# EasyEDA Pro project ProPrj_AD采集模组_2025-10-15.epro, board PCB1
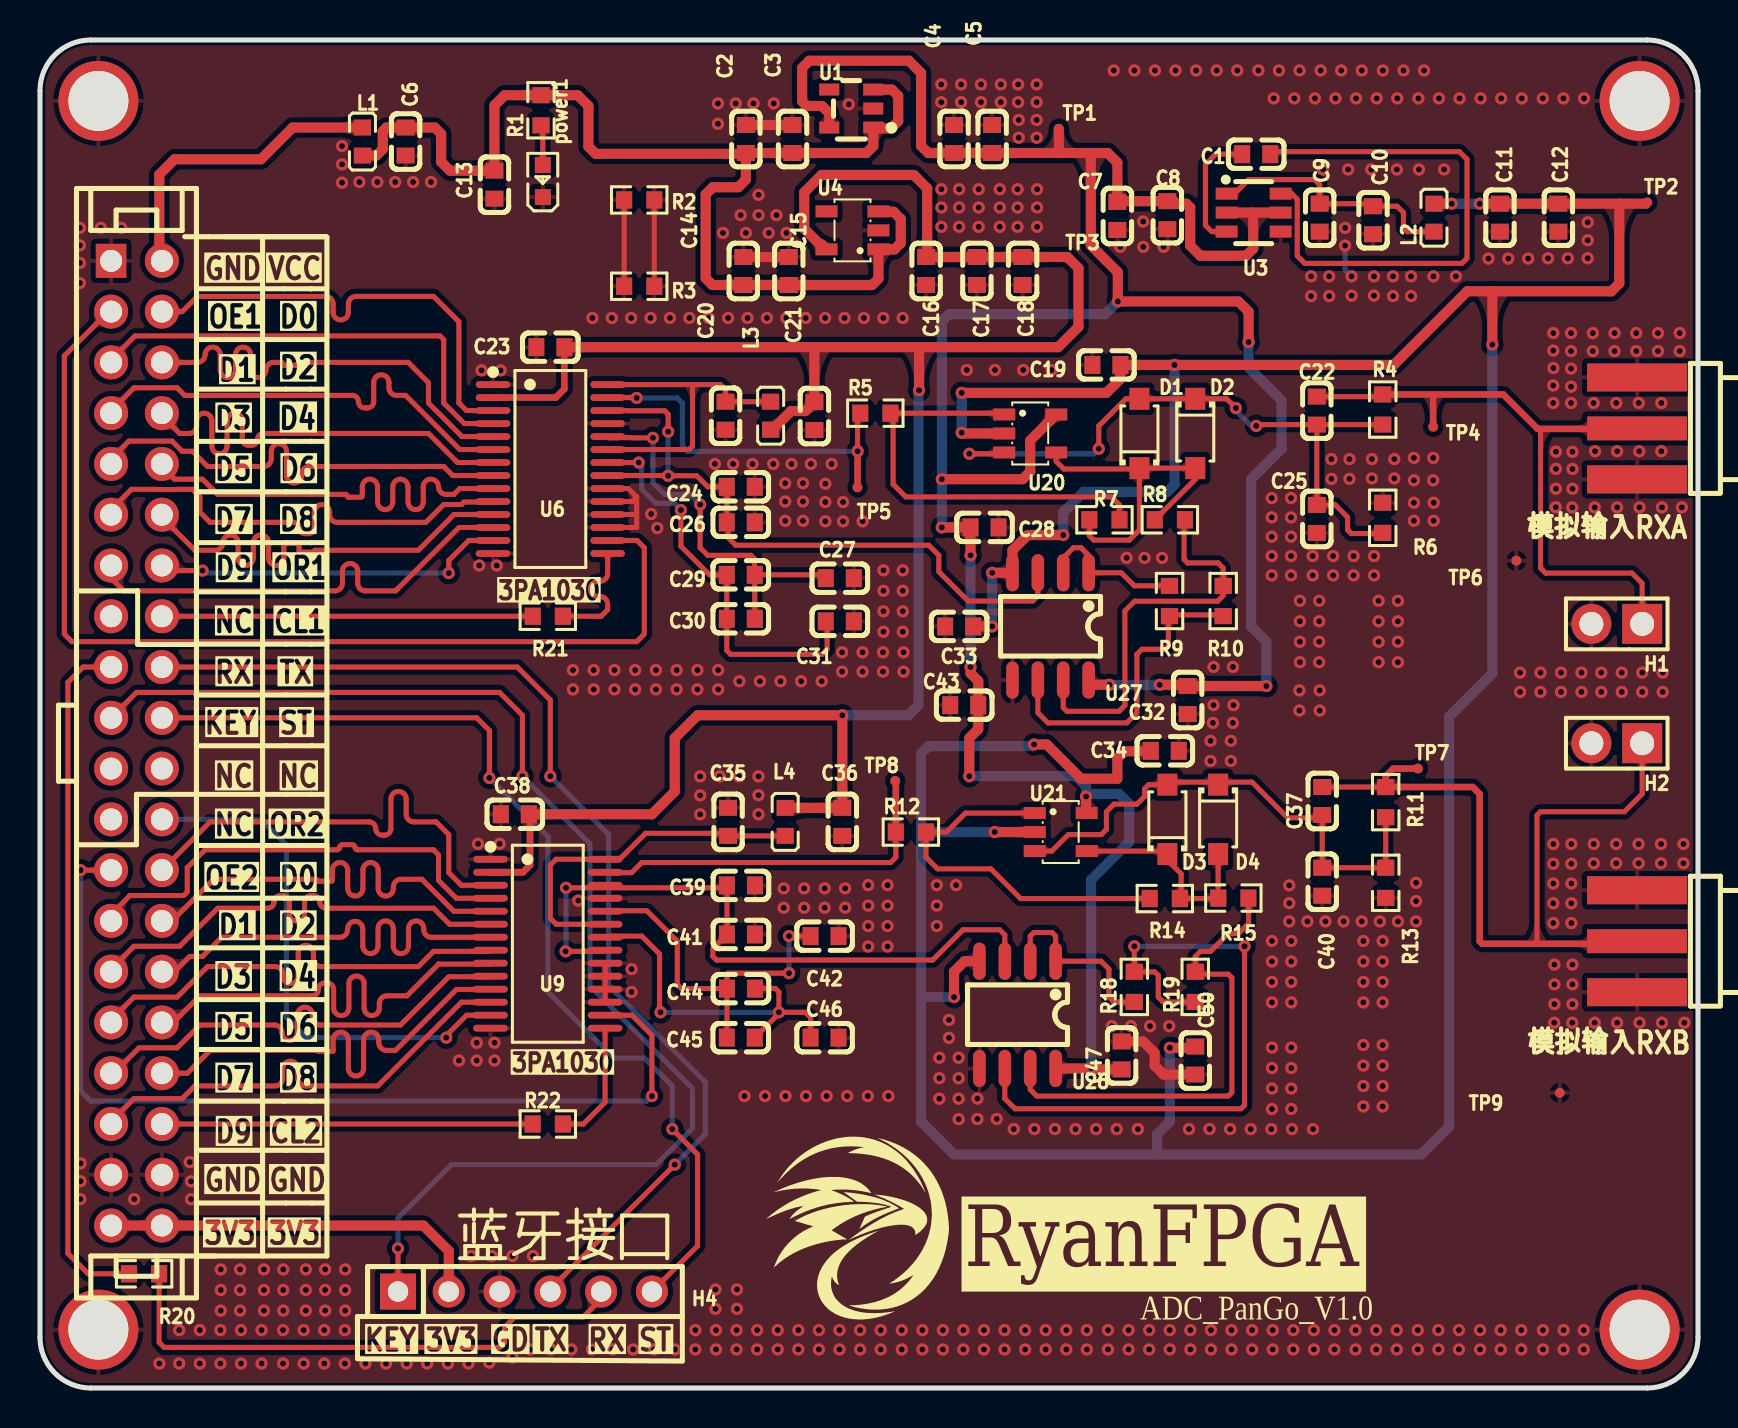
[diagram p1: board, top side]
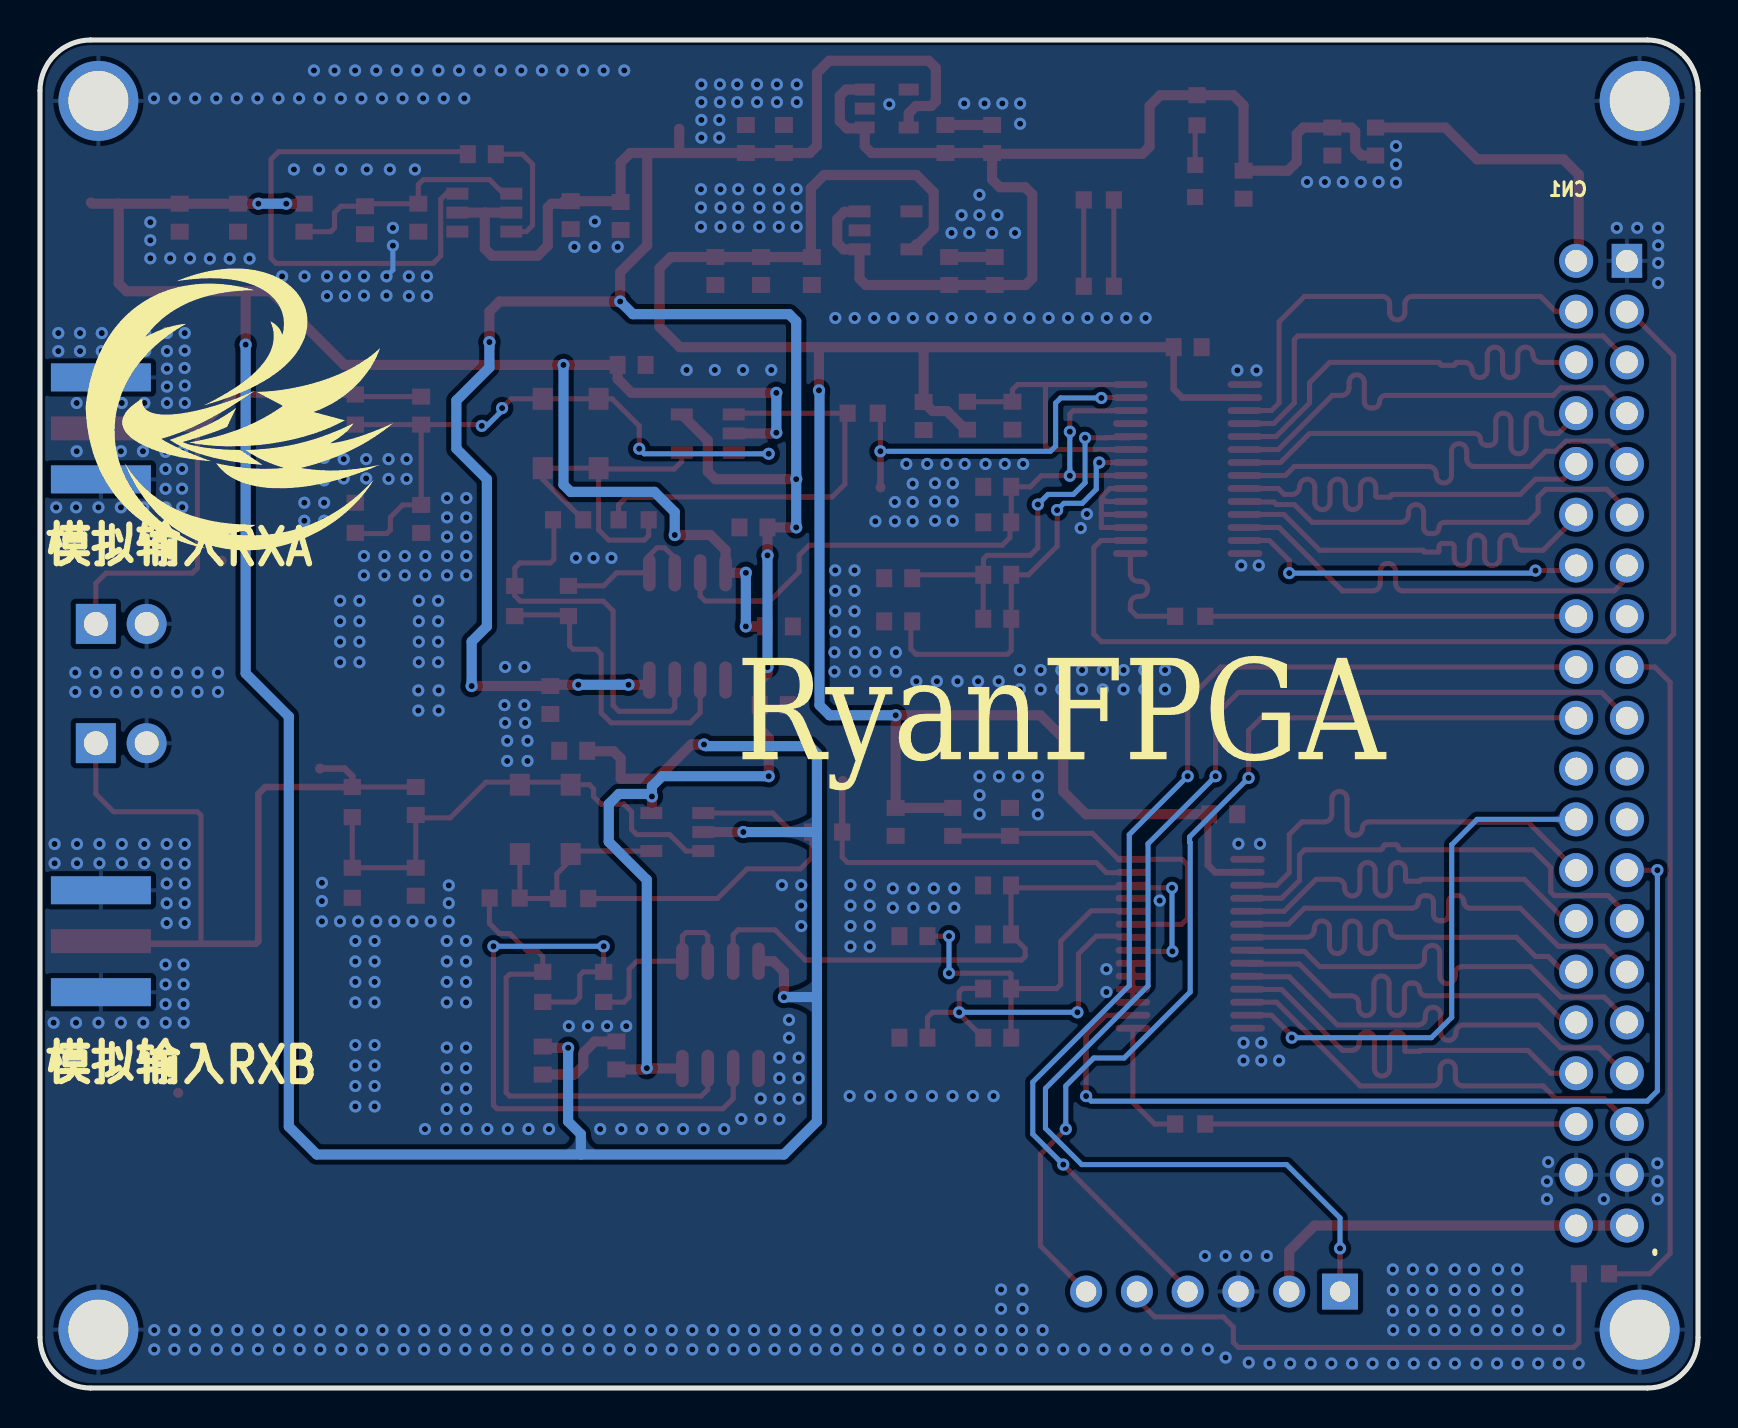
[diagram p2: board, bottom side, seen from below]

Outline 82.93 x 67.44 mm; copper layers: Top Layer, Bottom Layer. Coordinates in mm from the lower left corner of the outline.
Outline path: 0,64.9 0,2.54 arc(0.74,0.74) 2.54,0 80.39,0 arc(82.19,0.74) 82.93,2.54 82.93,64.9 arc(82.19,66.69) 80.39,67.44 2.54,67.44 arc(0.74,66.69) 0,64.9
Stack: Top Layer 0.035mm / Dielectric1 1.51mm FR4 er 4.5 / Bottom Layer 0.035mm

## Design rules (mm)
template: JLCPCB Capability(Two Layers Board)
spacing copperThickness1oz (default): track to track 0.102, other pairs 0.152 to 0.3
spacing copperThickness2oz: track to track 0.203, other pairs 0.152 to 0.3
track width copperThickness1oz (default): min 0.127, default 0.254, max 2.54
track width copperThickness2oz: min 0.203, default 0.254, max 2.54
differential pair differentialPair (default): width min 0.127, default 0.254, max 2.54; gap min 0.152, default 0.152
via viaSize (default): diameter min 0.5, default 0.61, max 10; hole min 0.3, default 0.305, max 6.3

## Placement (name value [footprint] x y rotation side)
C1  4.7uF  [C0603]  60.83 61.72 180 top
C2  47uf  [C0603]  35.31 62.48 270 top
C3  100nF  [C0603]  37.64 62.48 270 top
C4  100nF  [C0603]  45.72 62.48 270 top
C5  47uF  [C0603]  47.62 62.48 270 top
C6  47uF  [C0603]  18.29 62.36 90 top
C7  47uF  [C0603]  53.89 58.63 90 top
C8  100nF  [C0603]  56.39 58.67 90 top
C9  10uF  [C0603]  64.01 58.55 90 top
C10  4.7uF  [C0603]  66.68 58.42 90 top
C11  1uF  [C0603]  73.03 58.55 90 top
C12  47uF  [C0603]  75.95 58.55 90 top
C13  100nF  [C0603]  22.73 60.2 90 top
C14  47uF  [C0603]  35.18 55.88 270 top
C15  100nF  [C0603]  37.45 55.88 270 top
C16  100nF  [C0603]  44.32 55.88 90 top
C17  10uF  [C0603]  46.86 55.88 90 top
C18  47uF  [C0603]  49.15 55.88 90 top
C19  1uF  [C0603]  53.34 51.18 0 top
C20  100nF  [C0603]  34.29 48.64 270 top
C21  1uF  [C0603]  38.74 48.62 270 top
C22  NF  [C0603]  63.87 48.9 90 top
C23  100nF  [C0603]  25.53 52.07 180 top
C24  100nf  [C0603]  35.05 45.09 0 top
C25  NF  [C0603]  63.87 43.48 90 top
C26  10uf  [C0603]  35.05 43.31 0 top
C27  100nF  [C0603]  40 40.51 0 top
C28  1uF  [C0603]  47.24 43.05 180 top
C29  100nF  [C0603]  35.05 40.68 0 top
C30  10uF  [C0603]  35.05 38.48 0 top
C31  100nF  [C0603]  40 38.35 0 top
C32  1uF  [C0603]  57.4 34.42 270 top
C33  1uF  [C0603]  45.97 38.1 180 top
C34  1uF  [C0603]  56.26 31.88 180 top
C35  100nF  [C0603]  34.42 28.32 90 top
C36  1uF  [C0603]  40.13 28.32 270 top
C37  NF  [C0603]  64.13 29.37 90 top
C38  100nF  [C0603]  23.75 28.7 180 top
C39  10uF  [C0603]  35.06 25.14 0 top
C40  NF  [C0603]  64.13 25.33 90 top
C41  100nF  [C0603]  35.06 22.69 0 top
C42  100nF  [C0603]  39.24 22.61 0 top
C43  1uF  [C0603]  46.23 34.16 0 top
C44  100nF  [C0603]  35.06 19.98 180 top
C45  10uF  [C0603]  35.05 17.53 180 top
C46  100nF  [C0603]  39.24 17.53 0 top
C47  1uF  [C0603]  54.1 16.64 90 top
C50  1uF  [C0603]  57.78 16.38 270 top
CN1  2.54-2*20P压线头  [HDR-TH_40P-V-H-R2-P2.54]  4.83 32.26 270 top
D1  1N4148W  [SOD-123F_L2.7-W1.6-LS3.8-RD]  54.99 47.75 90 top
D2  1N4148W  [SOD-123F_L2.7-W1.6-LS3.8-RD]  57.78 47.75 270 top
D3  1N4148W  [SOD-123F_L2.7-W1.6-LS3.8-RD]  56.39 28.45 90 top
D4  1N4148W  [SOD-123F_L2.7-W1.6-LS3.8-RD]  58.93 28.45 270 top
H1  PZ254V-11-02P  [HDR-TH_2P-P2.54-V-M]  78.87 38.23 180 top
H2  PZ254V-11-02P  [HDR-TH_2P-P2.54-V-M]  78.87 32.26 180 top
H4  PM254V-11-06-H85  [HDR-TH_6P-P2.54-V-F]  24.26 4.83 0 top
L1  10uH  [L0603]  16.13 62.36 270 top
L2  120Ω@1A  [L0603]  69.72 58.55 90 top
L3  120Ω@1A  [L0603]  36.55 48.64 270 top
L4  120Ω@1A  [L0603]  37.27 28.32 90 top
NOREF  -  [Pad_e1874]  80.01 64.39 0 top
NOREF#2  -  [Pad_e1876]  2.92 2.92 0 top
NOREF#3  -  [Pad_e1872]  2.92 64.39 0 top
NOREF#4  -  [Pad_e1875]  80.01 2.92 0 top
power1  LTST-C193TBKT-5A  [LED_0603]  25.15 60.43 90 top
R1  1kΩ  [R0603]  25.06 63.92 90 top
R2  0Ω  [R0603]  29.97 59.44 0 top
R3  0Ω  [R0603]  29.97 55.12 0 top
R4  18kΩ  [R0603]  67.16 48.95 90 top
R5  22Ω  [R0603]  41.78 48.77 0 top
R6  2kΩ  [R0603]  67.16 43.53 90 top
R7  510Ω  [R0603]  53.24 43.43 180 top
R8  510Ω  [R0603]  56.51 43.43 0 top
R9  10kΩ  [R0603]  56.5 39.37 270 top
R10  10kΩ  [R0603]  59.18 39.37 90 top
R11  18kΩ  [R0603]  67.31 29.31 90 top
R12  22Ω  [R0603]  43.56 27.81 0 top
R13  2kΩ  [R0603]  67.31 25.27 270 top
R14  510Ω  [R0603]  56.26 24.49 0 top
R15  510Ω  [R0603]  59.69 24.51 0 top
R18  10kΩ  [R0603]  54.74 20.07 90 top
R19  10kΩ  [R0603]  57.78 20.07 90 top
R20  1K  [R0603]  5.21 5.72 180 top
R21  22R  [R0603]  25.4 38.61 180 top
R22  22R  [R0603]  25.4 13.21 180 top
RF1  KH-SMA-KE8-G  [CONN-SMD_KH-SMA-KE8-G]  79.88 48.01 270 top
RF2  KH-SMA-KE8-G  [CONN-SMD_KH-SMA-KE8-G]  79.88 22.35 270 top
TP1  -  [Test-Point-0.5mm]  50.96 62.99 0 top
TP2  -  [Test-Point-0.5mm]  80.39 59.31 0 top
TP3  -  [Test-Point-0.5mm]  51.45 56.51 0 top
TP4  -  [Test-Point-0.5mm]  69.68 48.09 0 top
TP5  -  [Test-Point-0.5mm]  40.89 45.06 0 top
TP6  -  [Test-Point-0.5mm]  73.84 41.39 0 top
TP7  -  [Test-Point-0.5mm]  68.92 30.99 0 top
TP8  -  [Test-Point-0.5mm]  42.78 30.37 0 top
TP9  -  [Test-Point-0.5mm]  76.02 14.77 0 top
U1  XC6204B282MR  [SOT-23-5_L2.9-W1.6-P0.95-LS2.8-BR]  40.58 64.01 0 top
U3  SGM3204YN6G/TR  [SOT-23-6_L2.9-W1.6-P0.95-LS2.8-BR]  60.71 58.8 180 top
U4  HXC6204B332MR  [SOT-23-5_L3.0-W1.7-P0.95-LS2.8-BR]  40.64 57.91 0 top
U6  3PA1030  [TSSOP-28_L9.7-W4.4-P0.65-LS6.4-BL]  25.53 45.97 270 top
U9  3PA1030  [TSSOP-28_L9.7-W4.4-P0.65-LS6.4-BL]  25.4 22.23 270 top
U20  TPH2501-TR  [SOT-23-5_L3.0-W1.7-P0.95-LS2.8-BR]  49.53 47.75 180 top
U21  TPH2501-TR  [SOT-23-5_L3.0-W1.7-P0.95-LS2.8-BR]  51.05 27.81 180 top
U26  TPH2502-SR  [SOP-8_L4.9-W3.9-P1.27-LS6.0-BL]  48.9 18.67 180 top
U27  TPH2502-SR  [SOP-8_L4.9-W3.9-P1.27-LS6.0-BL]  50.55 38.1 180 top

## Footprints (pads in the part's own frame, mm; a bottom-side part is the same pattern mirrored in y, then rotated)
C0603
  rect 0.8x0.9 smd: 1(-0.7,0) 2(0.7,0)
CONN-SMD_KH-SMA-KE8-G
  rect 1.4x5 smd: 1(-2.55,0) 2(2.55,0)
  rect 1.4x5 smd far side: 3(-2.55,0) 4(2.55,0)
  rect 1.2x5 smd: 5(0,0)
HDR-TH_2P-P2.54-V-M
  rect 2x2 hole 1.2: 1(-1.27,0)
  round 2 hole 1.2: 2(1.27,0)
HDR-TH_6P-P2.54-V-F
  rect 1.8x1.8 hole 1.02: 1(-6.35,0)
  round 1.6 hole 1.02: 2(-3.81,0) 3(-1.27,0) 4(1.27,0) 5(3.81,0) 6(6.35,0)
HDR-TH_40P-V-H-R2-P2.54
  rect 1.7x1.524 hole 1.1: 1(-24.13,-1.27)
  round 1.7 hole 1.1: 2(-24.13,1.27) 3(-21.59,-1.27) 4(-21.59,1.27) 5(-19.05,-1.27) 6(-19.05,1.27) 7(-16.51,-1.27) 8(-16.51,1.27) 9(-13.97,-1.27) 10(-13.97,1.27) 11(-11.43,-1.27) 12(-11.43,1.27) 13(-8.89,-1.27) 14(-8.89,1.27) 15(-6.35,-1.27) 16(-6.35,1.27) 17(-3.81,-1.27) 18(-3.81,1.27) 19(-1.27,-1.27) 20(-1.27,1.27) 21(1.27,-1.27) 22(1.27,1.27) 23(3.81,-1.27) 24(3.81,1.27) 25(6.35,-1.27) 26(6.35,1.27) 27(8.89,-1.27) 28(8.89,1.27) 29(11.43,-1.27) 30(11.43,1.27) 31(13.97,-1.27) 32(13.97,1.27) 33(16.51,-1.27) 34(16.51,1.27) 35(19.05,-1.27) 36(19.05,1.27) 37(21.59,-1.27) 38(21.59,1.27) 39(24.13,-1.27) 40(24.13,1.27)
L0603
  rect 0.8x0.864 smd: 1(-0.7,0) 2(0.7,0)
LED_0603
  rect 0.8x0.8 smd: 1(-0.851,-0.01) 2(0.75,-0.005)
Pad_e1872
  round 4 hole 3: 1(0,0)
Pad_e1874
  round 4 hole 3: 1(0,0)
Pad_e1875
  round 4 hole 3: 1(0,0)
Pad_e1876
  round 4 hole 3: 1(0,0)
R0603
  rect 0.806x0.864 smd: 1(-0.753,0) 2(0.753,0)
SOD-123F_L2.7-W1.6-LS3.8-RD
  rect 1.1x1 smd: 1(-1.735,0) 2(1.735,0)
SOP-8_L4.9-W3.9-P1.27-LS6.0-BL
  oval 0.63x1.865 smd: 1(-1.905,-2.683) 2(-0.635,-2.683) 3(0.635,-2.683) 4(1.905,-2.683) 5(1.905,2.683) 6(0.635,2.683) 7(-0.635,2.683) 8(-1.905,2.683)
SOT-23-5_L2.9-W1.6-P0.95-LS2.8-BR
  rect 1x0.6 smd: 1(1.1,-0.95) 2(1.1,0) 3(1.1,0.95) 4(-1.1,0.95) 5(-1.1,-0.95)
SOT-23-5_L3.0-W1.7-P0.95-LS2.8-BR
  rect 1.1x0.6 smd: 1(1.3,-0.95) 2(1.3,0) 3(1.3,0.95) 4(-1.3,0.95) 5(-1.3,-0.95)
SOT-23-6_L2.9-W1.6-P0.95-LS2.8-BR
  rect 1.1x0.6 smd: 1(1.35,-0.95) 2(1.35,0) 3(1.35,0.95) 4(-1.35,0.95) 5(-1.35,0) 6(-1.35,-0.95)
Test-Point-0.5mm
  round 0.5 smd: 1(0,0)
TSSOP-28_L9.7-W4.4-P0.65-LS6.4-BL
  oval 0.343x1.732 smd: 1(-4.225,-2.866) 2(-3.575,-2.866) 3(-2.925,-2.866) 4(-2.275,-2.866) 5(-1.625,-2.866) 6(-0.975,-2.866) 7(-0.325,-2.866) 8(0.325,-2.866) 9(0.975,-2.866) 10(1.625,-2.866) 11(2.275,-2.866) 12(2.925,-2.866) 13(3.575,-2.866) 14(4.225,-2.866) 15(4.225,2.866) 16(3.575,2.866) 17(2.925,2.866) 18(2.275,2.866) 19(1.625,2.866) 20(0.975,2.866) 21(0.325,2.866) 22(-0.325,2.866) 23(-0.975,2.866) 24(-1.625,2.866) 25(-2.275,2.866) 26(-2.925,2.866) 27(-3.575,2.866) 28(-4.225,2.866)

## Nets
As in the schematic, except:
AGND: C2.1 C3.1 C4.1 C5.1 C6.1 C7.1 C8.1 C9.1 C10.1 C11.1 C12.1 C13.1 C14.1 C15.1 C16.1 C17.1 C18.1 C19.1 C20.2 C21.2 C23.2 C24.2 C25.1 C26.2 C27.2 C28.1 C31.2 C32.2 C33.2 C34.1 C35.2 C36.2 C38.2 C39.2 C40.1 C41.2 C42.2 C43.1 C46.2 C47.2 C50.2 CN1.1 CN1.37 CN1.38 H1.2 H2.2 H4.3 NOREF.1 NOREF#2.1 NOREF#3.1 NOREF#4.1 power1.1 R2.1 R2.2 R3.1 R3.2 R6.2 R13.2 RF1.1 RF1.2 RF1.3 RF1.4 RF2.1 RF2.2 RF2.3 RF2.4 TP6.1 TP9.1 U1.2 U3.4 U4.2 U6.1 U6.14 U6.17 U6.18 U6.19 U6.20 U6.25 U9.1 U9.14 U9.17 U9.18 U9.19 U9.20 U9.25 U26.5 U27.5

Pads without a net: CN1 15 21 22 23; U1 4; U4 4

## Via types
v1: diameter 0.61, hole 0.305, Top Layer to Bottom Layer, 705 vias

## Routing (per net, layer and track width the routed paths; a pad name or vN(x,y) marks a point on that pad's centre or on a via; arc(x,y) is an arc through that point)
3V3: length 19.4
  Top Layer w0.508: H4.2 20.45,6.86 19.18,8.13 CN1.40 CN1.39
AGND: length 28.8
  Top Layer w0.254: 22.5,18.03 U9.14 ; U9.17 U9.18 U9.19 U9.20 ; 29.84,44.58 29.62,44.35 U6.19 ; 29.84,44.58 29.42,45 U6.20 ; 29.84,44.58 29.84,43.78 ; 30.73,55.63 R2.2 ; U6.17 29.84,43.05 29.84,43.05 29.84,43.78 ; R2.1 R3.1 ; 29.84,43.78 29.76,43.7 U6.18
  Top Layer w0.508: C47.2 55.18,17.34 55.75,16.76 55.75,16.13 56.2,15.68 C50.2 ; C14.1 37.45,56.58 ; C2.1 37.64,63.18
  Bottom Layer w0.254: v1(65.28,57.15) 65.28,55.94 v1(65.6,55.61)
  vias: v1(1.99,58.04) v1(1.99,57.16) v1(1.99,56.28) v1(1.99,55.28) v1(2.03,11.24) v1(2.03,10.34) v1(2.02,9.45) v1(3.04,58.04) v1(4.06,58.04) v1(4.71,9.45) v1(5.97,1.23) v1(6.96,2.9) v1(6.96,1.23) v1(7.49,11.3) v1(7.56,10.34) v1(7.56,9.45) v1(7.99,2.9) v1(7.99,1.23) v1(9.04,5.93) v1(9.04,4.9) v1(9.04,3.87) v1(9.02,2.9) v1(9.02,1.23) v1(10.01,5.93) v1(10.01,4.9) v1(10.01,3.87) v1(10.05,2.9) v1(10.05,1.23) v1(11.08,2.9) v1(11.08,1.23) v1(11.2,5.93) v1(11.2,4.9) v1(11.2,3.87) v1(12.17,5.93) v1(12.17,4.9) v1(12.17,3.87) v1(12.16,2.9) v1(12.16,1.23) v1(13.19,2.9) v1(13.19,1.23) v1(13.3,5.93) v1(13.3,4.91) v1(13.3,3.88) v1(14.22,2.9) v1(14.22,1.23) v1(14.26,5.93) v1(14.26,4.91) v1(14.26,3.88) v1(15.11,62.13) v1(15.11,61.21) v1(15.11,60.3) v1(15.25,2.9) v1(15.25,1.23) v1(15.26,5.93) v1(15.26,4.9) v1(15.26,3.87) v1(15.98,60.33) v1(16.28,1.23) v1(16.87,60.33) v1(17.31,1.23) v1(17.77,60.33) v1(18.34,1.23) v1(18.66,60.33) v1(19.37,1.23) v1(19.56,60.33) v1(20.4,1.23) v1(20.96,16.38) v1(21.43,1.23) v1(21.57,6.6) v1(21.84,17.27) v1(21.84,16.38) v1(21.91,27.22) v1(21.97,41.15) v1(22.08,50.91) v1(22.47,1.27) v1(22.6,6.6) v1(22.73,17.27) v1(22.73,16.38) v1(22.85,41.15) v1(23.04,50.91) v1(22.99,27.22) v1(23.63,6.6) v1(23.63,1.52) v1(24.52,1.93) v1(24.66,6.6) v1(25.55,1.93) v1(26.58,1.93) v1(26.66,35.92) v1(26.66,34.95) v1(26.92,24.38) v1(27.63,53.53) v1(27.61,1.93) v1(27.7,35.92) v1(27.7,34.95) v1(28.6,53.53) v1(28.64,1.93) v1(28.73,35.92) v1(28.73,34.95) v1(29.57,53.53) v1(29.59,20.96) v1(29.59,19.81) v1(29.67,1.93) v1(29.77,35.92) v1(29.77,34.95) v1(30.54,53.53) v1(30.57,43.72) v1(30.72,1.93) v1(30.81,35.92) v1(30.81,34.95) v1(30.88,43.02) v1(31.51,53.53) v1(31.85,35.92) v1(31.85,34.95) v1(31.75,1.93) v1(32.48,53.53) v1(32.78,2.9) v1(32.78,1.93) v1(32.88,35.92) v1(32.88,34.95) v1(33.02,30.6) v1(33.02,29.65) v1(33.02,28.7) v1(33.45,53.53) v1(33.76,46.23) v1(33.79,4.93) v1(33.79,3.96) v1(33.81,2.9) v1(33.81,1.93) v1(33.91,64.26) v1(33.91,63.25) v1(33.92,35.92) v1(33.92,34.95) v1(33.99,30.6) v1(34.16,57.79) v1(34.42,53.53) v1(34.67,46.23) v1(34.8,64.26) v1(34.84,2.9) v1(34.84,1.93) v1(34.86,4.93) v1(34.86,3.96) v1(35.05,58.67) v1(34.98,35.36) v1(34.96,30.6) v1(35.24,14.61) v1(35.31,57.79) v1(35.39,53.53) v1(35.64,46.23) v1(35.69,64.26) v1(35.94,59.69) v1(35.94,58.67) v1(35.94,30.6) v1(35.94,29.66) v1(35.94,28.7) v1(35.87,2.9) v1(35.87,1.93) v1(36.01,35.36) v1(36.27,14.61) v1(36.45,57.79) v1(36.36,53.53) v1(36.7,64.26) v1(36.68,46.23) v1(36.84,58.67) v1(36.9,2.9) v1(36.9,1.93) v1(37.04,35.36) v1(37.2,24.99) v1(37.2,24.03) v1(37.34,57.79) v1(37.33,53.53) v1(37.27,45.26) v1(37.27,44.35) v1(37.27,43.38) v1(37.29,14.61) v1(37.59,46.23) v1(37.93,2.9) v1(37.93,1.93) v1(38.07,35.36) v1(38.16,45.26) v1(38.16,44.35) v1(38.16,43.38) v1(38.22,24.99) v1(38.22,24.03) v1(38.3,53.53) v1(38.32,14.61) v1(38.56,46.23) v1(38.96,2.9) v1(38.96,1.93) v1(39.1,35.36) v1(39.25,24.99) v1(39.25,24.03) v1(39.27,53.53) v1(39.28,45.24) v1(39.28,44.32) v1(39.28,43.36) v1(39.35,14.61) v1(39.6,46.23) v1(39.99,2.9) v1(39.99,1.93) v1(40.12,36.81) v1(40.12,35.84) v1(40.24,53.53) v1(40.17,44.32) v1(40.17,43.36) v1(40.27,24.99) v1(40.27,24.03) v1(40.38,14.61) v1(40.45,64.22) v1(41.02,2.9) v1(41.02,1.93) v1(41.15,43.36) v1(41.14,36.81) v1(41.14,35.84) v1(41.21,53.53) v1(41.43,25.16) v1(41.43,24.13) v1(41.43,23.11) v1(41.43,22.09) v1(41.41,14.61) v1(42.05,2.9) v1(42.05,1.93) v1(42.18,53.53) v1(42.19,40.91) v1(42.19,39.88) v1(42.19,38.86) v1(42.19,37.83) v1(42.17,36.81) v1(42.17,35.84) v1(42.39,25.16) v1(42.39,24.13) v1(42.39,23.11) v1(42.39,22.09) v1(42.43,14.61) v1(43.1,2.9) v1(43.1,1.93) v1(43.15,53.53) v1(43.16,40.91) v1(43.16,39.88) v1(43.16,38.86) v1(43.16,37.83) v1(43.19,36.81) v1(43.19,35.84) v1(44.13,2.9) v1(44.13,1.93) v1(44.86,25.16) v1(44.86,24.13) v1(44.86,23.11) v1(44.98,16.52) v1(44.98,15.5) v1(44.98,14.47) v1(45.08,65.21) v1(45.08,64.33) v1(45.09,59.97) v1(45.09,59.06) v1(45.09,58.09) v1(45.16,2.9) v1(45.16,1.93) v1(45.47,18.42) v1(45.47,17.52) v1(45.82,25.16) v1(45.95,16.52) v1(45.95,15.5) v1(45.95,14.47) v1(45.95,13.45) v1(45.97,59.97) v1(45.97,59.06) v1(45.97,58.09) v1(46.07,65.21) v1(46.07,64.33) v1(46.19,2.9) v1(46.19,1.93) v1(46.35,50.93) v1(46.89,14.48) v1(46.89,13.46) v1(46.95,59.97) v1(46.95,59.06) v1(46.95,58.09) v1(47.06,65.21) v1(47.06,64.33) v1(47.21,2.9) v1(47.21,1.93) v1(47.77,50.93) v1(47.85,13.46) v1(48.01,59.97) v1(48.01,59.06) v1(48.01,58.09) v1(48.06,65.21) v1(48.06,64.33) v1(48.24,2.9) v1(48.24,1.93) v1(48.71,12.95) v1(48.92,65.21) v1(48.92,64.33) v1(48.9,59.97) v1(48.9,59.06) v1(48.9,58.09) v1(48.96,63.44) v1(48.96,62.55) v1(49.18,50.93) v1(49.27,2.9) v1(49.27,1.93) v1(49.74,12.95) v1(49.85,65.21) v1(49.85,64.33) v1(49.85,63.44) v1(49.85,62.55) v1(49.87,59.97) v1(49.87,59.06) v1(49.87,58.09) v1(50.3,2.9) v1(50.3,1.93) v1(50.59,50.93) v1(50.77,12.95) v1(51.33,2.9) v1(51.33,1.93) v1(51.8,12.95) v1(52.36,2.9) v1(52.36,1.93) v1(52.83,12.95) v1(53.42,2.9) v1(53.42,1.93) v1(53.61,18.1) v1(53.71,65.91) v1(53.86,12.95) v1(54.04,57.09) v1(54.35,41.53) v1(54.45,2.9) v1(54.45,1.93) v1(54.57,18.1) v1(54.74,65.91) v1(54.91,12.95) v1(55.18,58.36) v1(55.18,57.09) v1(55.25,41.53) v1(55.52,18.1) v1(55.48,2.9) v1(55.48,1.93) v1(55.77,65.91) v1(56.12,41.53) v1(56.2,57.09) v1(56.48,18.1) v1(56.51,2.9) v1(56.51,1.93) v1(56.8,65.91) v1(57.47,12.95) v1(57.54,2.9) v1(57.54,1.93) v1(57.83,65.91) v1(58.55,32.38) v1(58.55,31.37) v1(58.5,12.95) v1(58.57,2.9) v1(58.57,1.93) v1(58.7,36.07) v1(58.7,34.16) v1(58.67,33.27) v1(58.86,65.91) v1(59.53,12.95) v1(59.56,32.38) v1(59.56,31.37) v1(59.6,2.9) v1(59.6,1.93) v1(59.67,36.07) v1(59.7,34.16) v1(59.67,33.27) v1(59.89,65.91) v1(60.56,12.95) v1(60.63,2.9) v1(60.63,1.93) v1(60.94,65.91) v1(61.61,44.52) v1(61.61,43.55) v1(61.61,42.59) v1(61.61,41.62) v1(61.61,40.65) v1(61.62,22.36) v1(61.62,21.34) v1(61.62,20.32) v1(61.62,19.29) v1(61.62,17.03) v1(61.62,16.01) v1(61.62,14.98) v1(61.62,13.96) v1(61.59,12.95) v1(61.71,64.52) v1(61.66,2.9) v1(61.66,1.93) v1(61.97,65.91) v1(62.48,25.15) v1(62.48,24.26) v1(62.48,23.34) v1(62.57,44.52) v1(62.57,43.55) v1(62.57,42.59) v1(62.57,41.62) v1(62.57,40.65) v1(62.59,22.36) v1(62.59,21.34) v1(62.59,20.32) v1(62.59,19.29) v1(62.59,17.03) v1(62.59,16.01) v1(62.59,14.98) v1(62.59,13.96) v1(62.62,12.95) v1(62.74,64.52) v1(62.69,2.9) v1(62.69,1.93) v1(63,65.91) v1(63.02,39.38) v1(63.02,38.36) v1(63.02,37.33) v1(63.02,36.31) v1(62.99,34.9) v1(62.99,33.89) v1(63.39,23.34) v1(63.58,55.61) v1(63.58,54.62) v1(63.66,41.62) v1(63.66,40.65) v1(63.67,12.95) v1(63.72,2.9) v1(63.72,1.93) v1(63.77,64.52) v1(63.98,39.38) v1(63.98,38.36) v1(63.98,37.33) v1(63.98,36.31) v1(64.01,34.9) v1(64.01,33.89) v1(64.05,65.91) v1(64.18,60.96) v1(64.3,23.34) v1(64.48,55.61) v1(64.48,54.62) v1(64.59,46.47) v1(64.59,45.48) v1(64.68,41.62) v1(64.68,40.65) v1(64.75,2.9) v1(64.75,1.93) v1(64.8,64.52) v1(65.08,65.91) v1(65.2,23.34) v1(65.28,58.04) v1(65.43,60.96) v1(65.5,46.47) v1(65.5,45.48) v1(65.6,54.65) v1(65.7,41.62) v1(65.7,40.65) v1(65.83,64.52) v1(65.8,2.9) v1(65.8,1.93) v1(66.11,65.91) v1(66.11,23.34) v1(66.19,22.36) v1(66.19,21.34) v1(66.19,20.32) v1(66.19,19.29) v1(66.19,17.16) v1(66.19,16.13) v1(66.19,15.11) v1(66.19,14.09) v1(66.59,60.96) v1(66.62,46.47) v1(66.62,45.5) v1(66.72,55.61) v1(66.72,54.65) v1(66.73,41.62) v1(66.73,40.65) v1(66.83,2.9) v1(66.83,1.93) v1(66.86,64.52) v1(66.95,39.38) v1(66.95,38.36) v1(66.95,37.33) v1(66.95,36.31) v1(67.02,23.34) v1(67.17,65.91) v1(67.16,22.36) v1(67.16,21.34) v1(67.16,20.32) v1(67.16,19.29) v1(67.16,17.16) v1(67.16,16.13) v1(67.16,15.11) v1(67.16,14.09) v1(67.68,55.61) v1(67.68,54.62) v1(67.74,46.47) v1(67.74,45.5) v1(67.89,64.52) v1(67.87,60.96) v1(67.92,39.38) v1(67.92,38.36) v1(67.92,37.33) v1(67.92,36.31) v1(67.92,23.34) v1(67.86,2.9) v1(67.86,1.93) v1(68.2,65.91) v1(68.58,55.61) v1(68.58,54.62) v1(68.72,46.53) v1(68.72,45.41) v1(68.72,44.29) v1(68.72,43.39) v1(68.83,25.27) v1(68.83,24.36) v1(68.83,23.34) v1(68.94,64.52) v1(68.91,2.9) v1(68.91,1.93) v1(68.97,60.96) v1(69.23,65.91) v1(69.7,55.61) v1(69.69,46.53) v1(69.69,45.41) v1(69.71,44.29) v1(69.71,43.39) v1(69.94,2.9) v1(69.94,1.93) v1(69.97,64.52) v1(70.23,60.96) v1(70.82,55.61) v1(71,64.52) v1(70.97,2.9) v1(70.97,1.93) v1(72.03,2.9) v1(72.03,1.93) v1(72.05,64.52) v1(72.45,56.5) v1(73.08,64.52) v1(73.06,2.9) v1(73.06,1.93) v1(73.44,56.5) v1(74.03,35.79) v1(74.03,34.82) v1(74.11,64.52) v1(74.09,2.9) v1(74.09,1.93) v1(74.43,56.5) v1(75.05,35.79) v1(75.05,34.82) v1(75.17,64.52) v1(75.18,2.9) v1(75.18,1.93) v1(75.43,56.52) v1(75.69,52.78) v1(75.69,51.9) v1(75.7,51.03) v1(75.69,50.15) v1(75.69,49.28) v1(75.69,27.22) v1(75.69,26.23) v1(75.69,25.24) v1(75.69,24.25) v1(75.69,23.26) v1(75.75,21.18) v1(75.75,20.19) v1(75.75,19.2) v1(75.74,18.27) v1(75.82,46.84) v1(75.82,45.98) v1(75.82,44.99) v1(75.81,44.06) v1(76.08,35.79) v1(76.08,34.82) v1(76.2,64.52) v1(76.21,2.9) v1(76.21,1.93) v1(76.42,56.52) v1(76.58,52.78) v1(76.58,51.87) v1(76.58,51) v1(76.58,50.1) v1(76.58,49.28) v1(76.64,44.06) v1(76.59,27.22) v1(76.59,26.23) v1(76.59,25.24) v1(76.59,24.25) v1(76.59,23.26) v1(76.64,18.27) v1(76.65,46.84) v1(76.65,45.97) v1(76.65,44.99) v1(76.65,21.18) v1(76.65,20.19) v1(76.65,19.2) v1(77.1,35.79) v1(77.1,34.82) v1(77.23,64.52) v1(77.22,2.9) v1(77.22,1.93) v1(77.41,58.32) v1(77.41,57.42) v1(77.41,56.52) v1(77.67,52.78) v1(77.67,51.87) v1(77.71,49.28) v1(77.72,27.22) v1(77.72,26.25) v1(77.78,46.86) v1(77.76,44.06) v1(77.76,18.27) v1(78.09,35.79) v1(78.09,34.82) v1(78.75,52.78) v1(78.75,51.87) v1(78.84,49.28) v1(78.84,27.22) v1(78.84,26.25) v1(78.89,46.86) v1(78.88,44.06) v1(78.88,18.27) v1(79.12,35.79) v1(79.12,34.82) v1(79.84,52.78) v1(79.84,51.87) v1(79.97,49.28) v1(79.99,46.86) v1(80.01,44.06) v1(79.96,27.22) v1(79.96,26.25) v1(80.01,18.27) v1(80.14,35.79) v1(80.14,34.82) v1(80.93,52.78) v1(80.93,51.87) v1(81.1,49.28) v1(81.1,46.86) v1(81.13,44.06) v1(81.08,27.22) v1(81.08,26.25) v1(81.13,18.27) v1(81.16,35.79) v1(81.16,34.82) v1(82.01,52.78) v1(82.01,51.87) v1(82.12,44.06) v1(82.2,27.22) v1(82.2,26.25) v1(82.25,18.27)
VCC: length 115.3
  Top Layer w0.33: U6.2 25.8,49.55 26.23,49.98 26.23,52.07
  Top Layer w0.343: C38.1 24.51,28.64 24.51,26.16 24.15,25.8 U9.2
  Top Layer w0.508: 38.78,52.07 38.74,52.02 C21.1 38.28,48.87 37.57,48.87 36.63,47.94 L3.2 ; 38.78,52.07 26.23,52.07 ; 38.78,52.07 44.13,52.07 ; U4.5 39.09,57.22 39,57.22 38.23,57.99 38.23,59.82 39.09,60.68 43.71,60.68 44.37,60.02 44.37,56.58 46.48,56.58 ; C38.1 30.61,28.7 31.75,29.85 31.75,32.51 32.89,33.66 v1(40.13,33.66) C36.1 L4.2 ; 44.13,52.07 50.93,52.07 51.94,53.09 51.94,56.02 TP3.1 51.38,56.58 C18.2 46.48,56.58 ; 44.13,52.07 43.97,51.91 v1(43.97,49.91)
  Bottom Layer w0.508: v1(40.13,33.66) 43.43,33.66 43.94,34.16 43.94,49.88 v1(43.97,49.91)
VCC+: length 153.9
  Top Layer w0.508: 52.56,61.78 53.41,61.78 53.89,61.3 53.89,59.37 ; 52.56,61.78 52.56,57.17 53.91,55.82 v1(53.91,54.36) 59.94,54.36 60.45,53.85 v1(60.45,52.32) ; 52.56,61.78 50.87,61.78 ; v1(45.11,45.47) 49.15,45.47 49.53,45.85 49.53,47.4 U20.5 ; 60.66,58.8 U3.2 ; 60.66,58.8 60.68,58.78 60.68,57 60.32,56.64 58.04,56.64 57.53,57.15 57.53,59.06 57.34,59.25 56.83,59.25 56.7,59.37 53.89,59.37 ; 60.66,58.8 U3.5 ; v1(46.54,36.07) 46.54,35.75 46.93,35.37 C43.2 46.93,32.96 46.48,32.51 v1(46.48,30.61) ; v1(53.49,35.18) 52.56,35.18 ; v1(61.34,35.12) C32.1 57.34,35.18 v1(56.01,35.18) ; C47.1 52.64,15.94 v1(52.58,16) 52.56,15.99 U26.8 ; 53.89,59.37 C7.2 ; 50.87,61.78 50.96,61.87 TP1.1 ; 50.87,61.78 C5.2 45.72,61.78 44.43,61.78 44.07,62.14 44.07,65.79 43.46,66.4 38.48,66.4 38.12,66.04 38.12,64.37 38.35,64.14 39.12,64.14 39.48,63.77 U1.5 ; v1(45.11,43.05) C28.2 v1(46.54,41.66) ; v1(52.32,29.59) 52.32,28.79 U21.5
  Bottom Layer w0.508: v1(61.34,35.12) 61.34,37.34 60.58,38.1 60.58,45.47 62.1,46.99 62.1,49.4 60.45,51.05 v1(60.45,52.32) ; v1(45.11,43.05) v1(45.11,45.47) 45.11,53.36 45.47,53.72 53.28,53.72 v1(53.91,54.36) ; v1(46.48,30.61) 51.82,30.61 52.32,30.1 v1(52.32,29.59) 52.45,29.72 53.97,29.72 54.48,29.21 54.48,27.33 52.58,25.42 v1(52.58,16) ; v1(46.54,41.66) v1(46.54,36.07) ; v1(53.49,35.18) v1(56.01,35.18)
VCC-: length 195.1
  Top Layer w0.508: v1(72.01,59.25) C11.2 75.82,59.25 ; v1(46.1,49.78) 53.34,49.78 54.04,50.48 C19.2 ; U20.2 46.14,47.75 v1(46.1,47.79) ; C12.2 78.99,59.25 ; 78.99,59.25 80.33,59.25 ; 78.99,59.25 78.99,55.26 78.6,54.86 72.53,54.86 ; v1(47.62,40.78) U27.4 48.64,41.91 49.4,42.67 v1(51.18,42.67) ; U21.2 v1(47.75,27.81) ; 57.72,17.02 v1(56.51,17.02) ; 72.53,54.86 72.64,54.75 v1(72.64,52.2) ; 72.53,54.86 71.39,54.86 67.71,51.18 v1(56.75,51.18) 54.42,51.18 ; C34.2 55.54,31.86 54.25,31.86 53.89,31.5 53.89,30.48 52.07,30.48 50.36,32.19 v1(49.72,32.19) ; C33.1 v1(47.62,38.1) ; L2.2 v1(70.61,59.25) ; U26.4 46.24,21.35 45.72,20.83 v1(45.72,19.56) ; 75.88,59.18 75.95,59.12
  Bottom Layer w0.508: v1(46.1,49.78) v1(46.1,47.79) ; v1(47.75,27.81) 44.14,27.81 44.07,27.75 ; 55.85,11.68 55.88,11.71 55.88,12.7 56.51,13.34 v1(56.51,17.02) ; 55.85,11.68 69.09,11.68 70.49,13.08 70.49,33.59 72.64,35.75 v1(72.64,52.2) ; 55.85,11.68 45.72,11.68 44.07,13.34 44.07,19.53 ; v1(47.62,40.78) v1(47.62,38.1) ; 44.07,19.53 44.07,27.75 ; 44.07,19.53 44.09,19.56 v1(45.72,19.56) ; 44.07,27.75 44.07,31.75 44.43,32.11 49.63,32.11 v1(49.72,32.19) ; v1(51.18,42.67) 51.18,43.82 52.2,44.83 56.39,44.83 56.75,45.19 v1(56.75,51.18) ; v1(70.61,59.25) v1(72.01,59.25)
VCC_5V: length 61.3
  Top Layer w0.508: U1.3 42.61,64.96 42.93,64.64 42.93,63.37 42.57,63.01 41.72,63.01 U1.1 41.68,62.13 41.34,61.78 C3.2 35.31,61.78 ; C15.2 41.62,55.18 41.94,55.5 U4.1 42.74,56.96 43.05,57.28 43.05,58.48 42.69,58.84 41.96,58.84 U4.3 ; L1.2 16.83,61.66 17.14,61.98 17.14,62.87 17.34,63.06 C6.2 19.75,63.06 20.07,62.74 20.07,61.34 20.51,60.9 C13.2 22.73,64.17 23.24,64.67 R1.2 26.89,64.67 27.43,64.14 27.43,62.1 27.79,61.74 35.27,61.74 C2.2 35.31,60.45 34.93,60.07 33.66,60.07 33.3,59.71 33.3,55.52 33.63,55.18 C14.2 37.45,55.18
VCC_IN: length 15.5
  Top Layer w0.508: 5.97,56.39 5.97,60.71 6.73,61.47 11.05,61.47 12.64,63.06 L1.1
AD1_CLK: length 18.6
  Top Layer w0.254: 6.1,38.61 R21.2
AD1_D0: length 23.5
  Top Layer w0.254: 5.97,53.85 7.11,53.85 7.87,54.61 14.28,54.61 arc(14.55,54.5) 14.66,54.23 14.66,53.81 arc(15.04,53.43) 15.42,53.81 15.42,54.23 arc(15.54,54.5) 15.81,54.61 19.69,54.61 20.96,53.34 20.96,49.28 21.33,48.9 U6.3
AD1_D1: length 23.5
  Top Layer w0.254: U6.4 21.22,48.25 20.19,49.28 20.19,52.45 20.01,52.63 4.75,52.63 3.43,51.31
AD1_D2: length 23.5
  Top Layer w0.254: U6.5 21.11,47.6 19.43,49.28 19.43,50.29 18.41,51.31 12.97,51.31 arc(12.92,51.29) 12.9,51.24 arc(12.88,51.18) 12.83,51.16 12.21,51.16 arc(12.16,51.18) 12.14,51.24 arc(12.12,51.29) 12.06,51.31 11.68,51.31 arc(11.41,51.2) 11.3,50.93 arc(10.92,50.55) 10.54,50.93 10.54,51.69 arc(10.16,52.07) 9.78,51.69 9.78,50.93 arc(9.4,50.55) 9.02,50.93 9.02,51.69 arc(8.64,52.07) 8.25,51.69 arc(8.14,51.42) 7.87,51.31 5.97,51.31
AD1_D3: length 23.5
  Top Layer w0.254: U6.6 21,46.95 18.29,49.66 17.83,49.66 arc(17.57,49.77) 17.45,50.04 17.45,50.31 arc(17.07,50.69) 16.69,50.31 16.69,49.34 arc(16.6,49.12) 16.38,49.03 16.24,49.03 arc(16.02,49.12) 15.93,49.34 arc(15.84,49.56) 15.62,49.66 7.24,49.66 6.86,50.04 4.7,50.04 3.43,48.77
AD1_D4: length 23.5
  Top Layer w0.254: U6.7 20.88,46.3 19.43,47.75 11.18,47.75 arc(10.97,47.67) 10.88,47.46 arc(10.8,47.25) 10.59,47.16 10.42,47.16 arc(10.21,47.25) 10.12,47.46 10.12,48.39 arc(9.74,48.77) 9.36,48.39 9.36,47.12 arc(8.98,46.74) 8.6,47.12 8.6,48.39 arc(8.22,48.77) 7.83,48.39 7.83,48.13 arc(7.72,47.86) 7.45,47.75 6.98,47.75 5.97,48.77
AD1_D5: length 23.5
  Top Layer w0.254: 3.43,46.23 3.43,46.36 4.44,47.37 6.6,47.37 7.11,46.86 7.62,46.86 8.38,46.1 11.19,46.1 arc(11.46,46.21) 11.57,46.48 11.57,46.86 arc(11.95,47.24) 12.33,46.86 12.33,45.65 arc(12.71,45.27) 13.09,45.65 13.09,45.72 arc(13.21,45.99) 13.47,46.1 20.19,46.1 20.65,45.65 U6.8
AD1_D6: length 23.5
  Top Layer w0.254: 5.97,46.23 6.73,45.47 8.13,45.47 8.89,44.7 15.29,44.7 arc(15.34,44.68) 15.36,44.63 arc(15.38,44.59) 15.43,44.57 16.05,44.57 arc(16.1,44.59) 16.12,44.63 16.12,45.09 arc(16.5,45.47) 16.88,45.09 16.88,44.32 arc(17.26,43.94) 17.64,44.32 17.64,45.09 arc(18.03,45.47) 18.41,45.09 18.41,44.32 arc(18.79,43.94) 19.17,44.32 19.17,45.09 arc(19.55,45.47) 19.93,45.09 arc(20.04,44.82) 20.31,44.7 20.7,44.7 21,45 U6.9
AD1_D7: length 23.5
  Top Layer w0.254: U6.10 22.64,44.32 21.21,44.32 21.08,44.2 20.19,44.2 19.3,43.31 14.87,43.31 arc(14.6,43.42) 14.48,43.69 14.48,43.82 arc(14.1,44.2) 13.72,43.82 13.72,43.03 arc(13.64,42.83) 13.44,42.74 13.24,42.74 arc(13.04,42.83) 12.96,43.03 arc(12.88,43.22) 12.68,43.31 8.51,43.31 8,43.82 8,44.58 7.62,44.96 6.83,44.96 6.82,44.95 5.8,44.95 5.79,44.96 4.57,44.96 3.43,43.82 3.43,43.69
AD1_D8: length 23.5
  Top Layer w0.254: U6.11 20.71,43.7 18.92,41.91 13.77,41.91 arc(13.73,41.9) 13.72,41.87 arc(13.71,41.83) 13.68,41.82 13,41.82 arc(12.97,41.83) 12.96,41.87 12.96,42.08 arc(12.91,42.2) 12.79,42.25 12.37,42.25 arc(12.25,42.2) 12.2,42.08 12.2,41.53 arc(11.82,41.15) 11.44,41.53 11.44,42.29 arc(11.05,42.67) 10.67,42.29 10.67,41.53 arc(10.29,41.15) 9.91,41.53 9.91,42.29 arc(9.53,42.67) 9.15,42.29 arc(9.04,42.02) 8.77,41.91 7.75,41.91 5.97,43.69
AD1_D9: length 23.5
  Top Layer w0.254: 3.43,41.15 3.43,40.64 4.19,39.88 14.75,39.88 arc(15.02,39.99) 15.13,40.26 15.13,40.87 arc(15.51,41.25) 15.89,40.87 15.89,40.26 arc(16,39.99) 16.27,39.88 17.78,39.88 20.96,43.05 U6.12
AD1_OE: length 52.7
  Top Layer w0.254: U6.16 29.86,42.4 30.23,42.04 30.23,37.72 29.84,37.34 1.6,37.34 1.22,37.72 1.22,51.64 3.43,53.85
AD1_OTR: length 17.9
  Top Layer w0.254: v1(8.13,40.89) 6.22,40.89 5.97,41.15 ; U6.13 21.44,42.4 20.45,41.4 v1(20.45,40.77)
  Bottom Layer w0.254: v1(8.13,40.89) 8.25,40.77 v1(20.45,40.77)
AD2_CLK: length 18.6
  Top Layer w0.254: R22.2 CN1.36
AD2_D0: length 23.5
  Top Layer w0.254: U9.3 21.08,25.15 20.45,25.78 20.45,27.69 19.81,28.32 18.7,28.32 arc(18.43,28.43) 18.32,28.7 18.32,29.46 arc(17.93,29.85) 17.55,29.46 17.55,27.99 arc(17.46,27.75) 17.22,27.66 17.12,27.66 arc(16.89,27.75) 16.79,27.99 arc(16.69,28.22) 16.46,28.32 8.51,28.32 CN1.26 5.97,25.91
AD2_D1: length 23.5
  Top Layer w0.254: 3.43,23.37 3.43,23.57 4.5,24.64 7.19,24.64 7.37,24.82 7.37,26.04 8.25,26.92 14.86,26.92 arc(14.95,26.96) 14.99,27.05 arc(15.03,27.14) 15.12,27.18 15.62,27.18 arc(15.72,27.14) 15.75,27.05 arc(15.79,26.96) 15.88,26.92 19.68,26.92 19.93,26.67 19.93,25.39 20.83,24.5 U9.4
AD2_D2: length 23.5
  Top Layer w0.254: U9.5 20.7,23.85 19.1,25.45 18.06,25.45 arc(17.79,25.34) 17.68,25.07 17.68,24.99 arc(17.3,24.61) 16.91,24.99 16.91,25.91 arc(16.53,26.29) 16.15,25.91 16.15,24.99 arc(15.77,24.61) 15.39,24.99 15.39,25.91 arc(15.01,26.29) 14.63,25.91 14.63,25.4 arc(14.61,25.37) 14.58,25.36 13.91,25.36 arc(13.88,25.37) 13.87,25.4 arc(13.85,25.44) 13.82,25.45 8.69,25.45 6.6,23.37 5.97,23.37
AD2_D3: length 23.4
  Top Layer w0.254: 22.53,23.2 20.49,23.2 19.69,24 14.31,24 arc(14.09,24.1) 14,24.32 arc(13.9,24.54) 13.68,24.63 13.55,24.63 arc(13.33,24.54) 13.23,24.32 13.23,23.69 arc(13.14,23.47) 12.92,23.37 12.79,23.37 arc(12.56,23.47) 12.47,23.69 12.47,24.32 arc(12.38,24.54) 12.16,24.63 12.02,24.63 arc(11.8,24.54) 11.71,24.32 arc(11.62,24.1) 11.39,24 8.89,24 6.98,22.1 4.7,22.1 3.43,20.83
AD2_D4: length 23.5
  Top Layer w0.254: 5.97,20.83 6.73,20.83 7.49,21.59 8.13,21.59 9.09,22.55 15,22.55 arc(15.27,22.66) 15.38,22.93 15.38,22.97 arc(15.77,23.35) 16.15,22.97 16.15,22.11 arc(16.53,21.73) 16.91,22.11 16.91,22.99 arc(17.29,23.37) 17.67,22.99 17.67,22.11 arc(18.05,21.73) 18.43,22.11 18.43,22.99 arc(18.81,23.37) 19.19,22.99 19.19,22.93 arc(19.31,22.66) 19.57,22.55 U9.7
AD2_D5: length 23.5
  Top Layer w0.254: U9.8 22.48,21.84 19.69,21.84 18.92,21.08 14.06,21.08 arc(13.79,21.19) 13.68,21.46 13.68,21.77 arc(13.3,22.15) 12.92,21.77 12.92,20.61 arc(12.53,20.23) 12.15,20.61 12.15,20.7 arc(12.04,20.97) 11.77,21.08 8.38,21.08 6.86,19.56 4.7,19.56 3.43,18.29
AD2_D6: length 23.5
  Top Layer w0.254: U9.9 22.49,21.21 19.94,21.21 18.35,19.62 17.35,19.62 arc(17.09,19.51) 16.97,19.24 16.97,19.01 arc(16.59,18.63) 16.21,19.01 16.21,20.23 arc(15.83,20.61) 15.45,20.23 15.45,19.01 arc(15.07,18.63) 14.69,19.01 14.69,19.94 arc(14.59,20.17) 14.37,20.26 14.25,20.26 arc(14.02,20.17) 13.93,19.94 arc(13.83,19.71) 13.61,19.62 8,19.62 6.67,18.29 5.97,18.29
AD2_D7: length 23.5
  Top Layer w0.254: 3.43,15.75 3.68,15.75 4.95,17.02 6.86,17.02 8,18.16 11.73,18.16 arc(12,18.05) 12.11,17.78 12.11,17.77 arc(12.49,17.39) 12.87,17.77 12.87,18.67 arc(13.25,19.05) 13.63,18.67 13.63,18.54 arc(13.75,18.27) 14.01,18.16 18.03,18.16 20.45,20.57 22.51,20.57 U9.10
AD2_D8: length 23.5
  Top Layer w0.254: U9.11 22.52,19.94 20.83,19.94 17.78,16.89 17.33,16.89 arc(17.06,17) 16.95,17.27 16.95,17.42 arc(16.57,17.81) 16.19,17.42 16.19,15.99 arc(15.81,15.61) 15.42,15.99 15.42,17.42 arc(15.04,17.81) 14.66,17.42 14.66,16.87 arc(14.65,16.85) 14.64,16.84 13.92,16.84 arc(13.91,16.85) 13.9,16.87 arc(13.89,16.88) 13.88,16.89 8.51,16.89 7.37,15.75 5.97,15.75
AD2_D9: length 23.5
  Top Layer w0.254: 3.43,13.21 4.7,14.48 7.11,14.48 7.75,15.11 11.76,15.11 arc(12.03,15.22) 12.14,15.49 12.14,15.97 arc(12.52,16.35) 12.9,15.97 12.9,15.49 arc(13.01,15.22) 13.28,15.11 16.89,15.11 21.08,19.3 U9.12
AD2_OE: length 47.1
  Top Layer w0.254: U9.16 29.61,18.65 30.61,17.65 v1(30.61,14.61) ; v1(2.03,25.91) 3.43,25.91
  Bottom Layer w0.254: v1(30.61,14.61) 30.35,14.35 2.54,14.35 2.03,14.86 v1(2.03,25.91)
AD2_OTR: length 26.4
  Top Layer w0.254: 20.46,17.77 21.34,18.65 U9.13
  Bottom Layer w0.254: v1(20.32,17.53) 13.33,17.53 12.32,18.54 12.32,27.18 11.05,28.45 5.97,28.45
KEY: length 65.8
  Top Layer w0.254: v1(17.91,6.99) H4.1 ; v1(24.13,30.61) 24.13,33.66 22.99,34.8 4.83,34.8 CN1.19
  Bottom Layer w0.254: 17.91,7.24 17.91,8.51 20.57,11.18 30.82,11.18 32.64,12.99 32.64,14.99 27.51,20.12 27.51,27.23 v1(24.13,30.61)
RX: length 27.5
  Top Layer w0.254: H4.5 28.07,4.45 27.18,3.56 23.75,3.56 23.24,3.05 23.24,2.29 22.99,2.03 6.21,2.03 5.96,2.29 R20.1
STATE: length 50.7
  Top Layer w0.254: 22.48,30.73 22.48,32.89 21.84,33.53 CN1.20 ; H4.6 32.89,7.11 32.89,11.68 v1(31.62,12.95)
  Bottom Layer w0.254: v1(31.62,12.95) 31.62,15.11 30.23,16.51 28.7,16.51 25.4,19.81 25.4,27.28 25.43,27.31 25.43,27.57 v1(22.48,30.52)
TX: length 56.1
  Top Layer w0.254: v1(31.75,11.18) 25.53,4.95 H4.4 ; v1(25.53,30.61) 25.53,34.42 23.88,36.07 CN1.18
  Bottom Layer w0.254: v1(25.53,30.61) 28.45,27.69 28.45,20.13 33.27,15.3 33.27,12.7 v1(31.75,11.18)
$1N1392: length 32.7
  Top Layer w0.254: R4.2 67.05,49.6 C22.2 ; H1.1 80.14,40.26 79.63,40.77 75.31,40.77 75.06,41.02 75.06,47.84 74.91,47.99
  Top Layer w0.33: 69.71,49.7 R4.2 ; 69.71,49.7 73.19,49.7 74.91,47.99 79.74,47.99 79.76,48.01 ; 69.71,49.7 69.68,49.68 TP4.1
$1N2309: length 17.7
  Top Layer w0.254: D1.1 54.95,45.97 51.21,45.97 50.83,46.36 U20.4 ; D1.1 D2.2 57.78,45.46 R8.1 ; D1.1 54.99,42.93 54.48,42.42 52.71,42.42 52.49,42.64 R7.2
$1N2656: length 20.5
  Top Layer w0.254: 51.18,35.8 51.18,34.04 51.36,33.86 53.97,33.86 54.27,34.15 54.27,38.88 54.75,39.36 58.9,39.36 59.18,39.64 R10.2 59.18,41.02 58.93,41.28 57.4,41.28 57.22,41.45 57.22,43.39 R8.2
$1N3284: length 18
  Top Layer w0.254: R5.1 40.89,48.63 v1(40.89,46.86) ; U6.27 29.59,49.55
  Top Layer w0.33: v1(40.89,46.86) 40.89,45.06 TP5.1
  Bottom Layer w0.254: v1(29.84,49.53) 31.88,49.53 32.13,49.28 32.13,47.12 32.38,46.86 40.51,46.86
$1N3290: length 21.8
  Top Layer w0.254: U20.1 48.16,48.77 R5.2 42.67,48.63 42.67,45.21 43.31,44.58 53.59,44.58 53.99,44.18 R7.1
$1N3540: length 16.3
  Top Layer w0.254: U6.28 32.6,50.2 ; 32.6,50.2 34.04,50.2 34.29,49.95 C20.1 L3.1 ; 32.6,50.2 32.64,50.16 32.64,47.12 32.47,46.95 U6.23
$1N3734: length 19.9
  Top Layer w0.254: v1(32.06,43.92) 32.06,42.11 33.49,40.68 C29.1 34.35,38.99 ; C30.1 34.35,36.9 34.54,36.7 39.12,36.7 39.37,36.96 39.37,38.29 C31.1 ; U6.22 v1(29.95,46.3)
  Bottom Layer w0.254: v1(32.06,43.92) 31.72,44.26 30.8,44.26 30.1,44.96 30.1,46.15 v1(29.95,46.3)
$1N3888: length 18.9
  Top Layer w0.254: C27.1 39.14,40.68 C29.2 ; v1(30.66,47.53) 29.62,47.53 29.6,47.55 28.91,47.55 28.9,47.53 28.46,47.53 U6.24 ; C29.2 35.74,40.7 35.74,41.48 35.56,41.66 33.4,41.66 33.02,42.04 v1(33.02,44.2) ; C29.2 C30.2
  Bottom Layer w0.254: v1(30.66,47.53) 30.66,45.29 31.24,44.7 32.51,44.7 32.89,44.32
$1N4080: length 6.3
  Top Layer w0.254: R21.1 28.07,38.61 28.39,38.93 28.39,39.22 arc(28.28,39.49) 28.01,39.6 27.91,39.6 arc(27.53,39.98) 27.91,40.36 28.01,40.36 arc(28.28,40.47) 28.39,40.74 U6.15
$1N10331: length 27.6
  Top Layer w0.254: C1.1 61.66,61.85 70.99,61.85 71.37,61.47 71.37,56.52 71.12,56.26 63.27,56.26 62.88,56.64 62.88,59.47 62.56,59.8 62.1,59.8 U3.6
$1N10336: length 6.3
  Top Layer w0.254: C1.2 58.8,61.72 58.29,61.21 58.29,58.17 58.61,57.85 U3.3
$1N10485: length 12.7
  Top Layer w0.254: L2.1 68.39,57.85 68.2,58.04 68.2,58.8 67.88,59.12 C10.2 66.55,59.25 C9.2 64.01,60.2 63.75,60.45 60.45,60.45 59.75,59.75 U3.1
$1N11129: length 2
  Top Layer w0.254: R1.1 25.15,63.07 25.15,61.18
$1N12612: length 40.3
  Top Layer w0.254: 80.39,32.26 80.14,32 80.14,29.72 79.25,28.83 75.06,28.83 74.88,28.65 74.88,22.24 74.86,22.23 ; 67.31,30.06 67.31,30.07 C37.2
  Top Layer w0.33: 79.88,22.23 72.14,22.23 72.01,22.35 72.01,29.72 71.66,30.06 67.31,30.06 67.31,30.61 67.69,30.99 68.79,30.99
$1N12618: length 10.3
  Top Layer w0.254: 57.02,24.49 57.08,24.55 57.08,25.72 56.51,26.29 56.51,26.59 D3.1 56.24,26.86 U21.4 ; 57.02,24.49 R14.2 ; 57.02,24.49 58.91,24.49 R15.1 ; D4.2 58.93,25.02
$1N12621: length 24.4
  Top Layer w0.254: U26.7 49.53,14.93 49.86,14.61 59.44,14.61 59.62,14.78 59.62,20.52 59.44,20.7 57.9,20.7 R19.2 57.78,21.59 58.04,21.84 58.55,21.84 59.44,22.73 59.94,22.73 60.45,23.24 60.45,24.5 R15.2
$1N12626: length 18.7
  Top Layer w0.254: R12.1 42.81,26.55 42.54,26.29 30.1,26.29 29.59,25.78 28.28,25.78 U9.27
  Top Layer w0.33: R12.1 42.81,30.34 TP8.1
$1N12627: length 19.1
  Top Layer w0.254: U21.1 46.29,28.76 45.34,27.81 R12.2 44.31,26.55 44.89,25.97 47.56,25.97 49.05,24.49 R14.1
$1N12628: length 33.5
  Top Layer w0.254: U26.3 48.26,22.67 48.01,22.92 46.16,22.92 44.65,21.41 33.83,21.41 33.66,21.59 33.66,21.98 34.36,22.69 34.36,25.14 34.24,25.02 26.54,25.02 ; v1(26.29,21.84) 28.19,21.84
  Bottom Layer w0.254: v1(26.31,25.02) 26.31,21.87 v1(26.29,21.84)
$1N12630: length 17.9
  Top Layer w0.254: L4.1 C35.1 34.29,27.75 30.29,27.75 28.99,26.45 25.81,26.45 25.53,26.16 25.53,23.5 25.82,23.2 28.14,23.2
$1N12634: length 18.5
  Top Layer w0.254: C46.1 38.54,18.54 38.29,18.8 v1(36.96,18.8) ; v1(36.96,18.8) 36.96,18.73 C45.1 ; v1(36.96,18.8) 36.96,19.81 36.78,19.99 35.77,19.99 C44.1 ; 28.45,22.61 30.1,22.61 30.99,21.72 30.99,18.85 v1(31.04,18.8)
  Bottom Layer w0.254: v1(31.04,18.8) v1(36.96,18.8)
$1N12635: length 18.1
  Top Layer w0.254: 34.36,19.98 32.09,19.98 31.88,20.19 31.88,22.35 30.35,23.88 28.42,23.88 ; 34.36,19.98 34.36,20.7 34.41,20.75 v1(37.47,20.75) ; 34.36,19.98 34.36,17.54 C45.2 ; v1(37.47,22.61) 38.54,22.61
  Bottom Layer w0.254: v1(37.47,20.75) 37.47,22.61
$1N17421: length 33
  Top Layer w0.254: v1(59.82,49.02) 59.35,49.49 D2.1 D1.2 54.31,49.49 52.96,48.13 v1(52.96,46.99) ; v1(60.83,48.13) 60.9,48.2 C22.1 ; R4.1 67.16,48.2 C22.1 ; R6.1 67.13,42.75 65.58,42.75 65.41,42.93 65.41,43.56 64.79,44.18 C25.2 C22.1 ; U20.3 48.16,46.74 v1(46.48,46.74)
  Bottom Layer w0.254: v1(59.82,49.02) 59.82,48.9 60.58,48.13 ; v1(46.48,46.74) 52.71,46.74 v1(52.96,46.99)
$1N17460: length 25.7
  Top Layer w0.254: R11.1 R13.1 67.31,26.03 C40.2 C37.1 63.99,28.52 62.41,28.52 60.62,30.31 56.51,30.31 D3.2 55.46,30.18 55.25,29.97 55.25,29.59 54.86,29.21 53.72,29.21 53.34,28.83 53.34,27.94 53.09,27.69 51.44,27.69 50.61,26.86 U21.3
$1N58701: length 34.5
  Top Layer w0.254: R20.2 2.41,5.72 1.4,6.73 1.4,35.31 2.16,36.07 CN1.17
$1N80519: length 9.5
  Top Layer w0.254: R18.1 54.73,19.3 53.72,19.3 53.47,19.56 53.47,20.96 53.07,21.35 U26.1 50.8,22.61 50.62,22.79 49.71,22.79 49.53,22.61 U26.2
$1N80652: length 32.8
  Top Layer w0.254: v1(54.74,22.1) R18.2 55.75,20.82 55.93,20.64 55.93,19.56 56.18,19.31 R19.1 ; U26.6 48.26,14.48 48.77,13.97 60.07,13.97 60.25,14.15 v1(60.25,22.1)
  Bottom Layer w0.254: v1(60.25,22.1) v1(54.74,22.1)
$1N81228: length 33.5
  Top Layer w0.254: U6.26 29.34,48.9 29.35,48.89 31.25,48.89 31.42,48.72 v1(31.42,47.84) ; U6.21 31.41,45.65 v1(31.42,45.64) 32.85,45.64 33.4,45.09 C24.1 C26.1 34.42,43.24 34.42,42.55 34.8,42.16 44.45,42.16 44.96,41.66 44.96,40.84 46.42,39.37 49.66,39.37 49.91,39.62 U27.3
  Bottom Layer w0.254: v1(31.42,45.64) v1(31.42,47.84)
$1N81237: length 7.6
  Top Layer w0.254: R9.1 56.49,40.13 54.74,40.13 54.09,40.78 U27.1 52.45,41.66 52.07,42.04 51.69,42.04 51.18,41.53 U27.2
$1N81279: length 15.7
  Top Layer w0.254: 49.91,35.29 49.91,33.78 50.42,33.27 54.36,33.27 54.86,33.78 54.86,36.7 55.12,36.96 56.26,36.96 56.44,37.14 56.44,38.56 R9.2 56.56,38.68 59.12,38.68
$1N84264: length 6.3
  Top Layer w0.254: R22.1 27.18,13.21 28.27,14.3 U9.15

## Copper pours and planes (outline as drawn; the poured copper is in the pictures)
AGND on Top Layer: -1.14,69.98 85.6,69.98 85.6,-1.91 -1.14,-1.91
AGND on Bottom Layer: -3.81,71.25 88.14,71.25 88.14,-4.19 -3.81,-4.19

Small or netless copper shapes (teardrops, artwork), in the pictures only: 362 on Top Layer, 59 on Bottom Layer

## Text on the board
Bottom Silkscreen Layer: RyanFPGA | 模拟输入RXA | 模拟输入RXB
Top Silkscreen Layer: 3PA1030 | VCC | 3V3 | GND | KEY | OE2 | OE1 | NC | D3 | D5 | D7 | RX | D9 | D1 | OR2 | CL2 | OR1 | CL1 | D4 | D0 | D2 | D8 | TX | ST | D6 | GD | RyanFPGA | ADC_PanGo_V1.0 | 蓝牙接口 | 模拟输入RXA | 模拟输入RXB
